# Altium schematic sheet ADC inputs.SchDoc
size A4
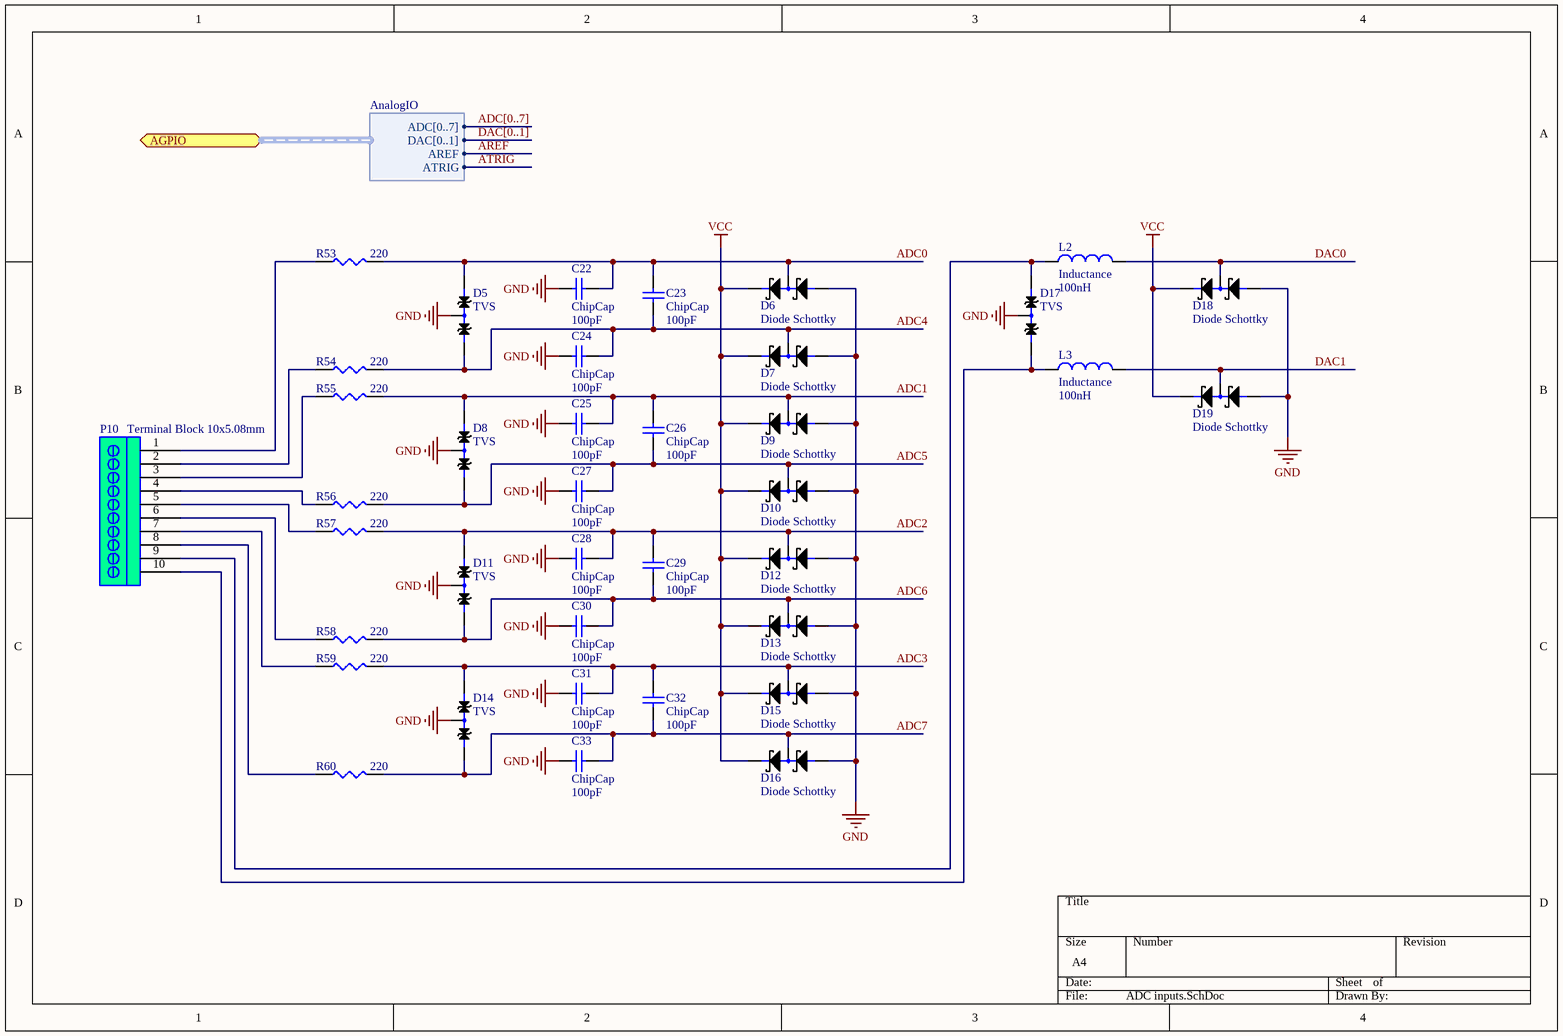
[diagram p0: ADC inputs.SchDoc]

## Parts
C22  ChipCap  value 100pF  [CAP0805]
C23  ChipCap  value 100pF  [CAP0805]
C24  ChipCap  value 100pF  [CAP0805]
C25  ChipCap  value 100pF  [CAP0805]
C26  ChipCap  value 100pF  [CAP0805]
C27  ChipCap  value 100pF  [CAP0805]
C28  ChipCap  value 100pF  [CAP0805]
C29  ChipCap  value 100pF  [CAP0805]
C30  ChipCap  value 100pF  [CAP0805]
C31  ChipCap  value 100pF  [CAP0805]
C32  ChipCap  value 100pF  [CAP0805]
C33  ChipCap  value 100pF  [CAP0805]
D5  TVS  [SOT23]
D6  Diode Schottky  [SOT23]
D7  Diode Schottky  [SOT23]
D8  TVS  [SOT23]
D9  Diode Schottky  [SOT23]
D10  Diode Schottky  [SOT23]
D11  TVS  [SOT23]
D12  Diode Schottky  [SOT23]
D13  Diode Schottky  [SOT23]
D14  TVS  [SOT23]
D15  Diode Schottky  [SOT23]
D16  Diode Schottky  [SOT23]
D17  TVS  [SOT23]
D18  Diode Schottky  [SOT23]
D19  Diode Schottky  [SOT23]
L2  Inductance  value 100nH  [CM45]
L3  Inductance  value 100nH  [CM45]
P10  Terminal Block 10x5.08mm  [Socket 10x5.08]
R53  value 220  [RES0805]  (hidden comment: ChipRes)
R54  value 220  [RES0805]  (hidden comment: ChipRes)
R55  value 220  [RES0805]  (hidden comment: ChipRes)
R56  value 220  [RES0805]  (hidden comment: ChipRes)
R57  value 220  [RES0805]  (hidden comment: ChipRes)
R58  value 220  [RES0805]  (hidden comment: ChipRes)
R59  value 220  [RES0805]  (hidden comment: ChipRes)
R60  value 220  [RES0805]  (hidden comment: ChipRes)

## Ports
AGPIO (harness AnalogIO)

## Harnesses
AnalogIO: ADC[0..7], DAC[0..1], AREF, ATRIG

## Nets
GND: C22.2 C24.2 C25.2 C27.2 C28.2 C30.2 C31.2 C33.2 D5.3 D6.1 D7.1 D8.3 D9.1 D10.1 D11.3 D12.1 D13.1 D14.3 D15.1 D16.1 D17.3 D18.1 D19.1
VCC: D6.2 D7.2 D9.2 D10.2 D12.2 D13.2 D15.2 D16.2 D18.2 D19.2
ADC0: C22.1 C23.2 D5.1 D6.3 R53.2
ADC1: C25.1 C26.2 D8.1 D9.3 R55.2
ADC2: C28.1 C29.2 D11.1 D12.3 R57.2
ADC3: C31.1 C32.2 D14.1 D15.3 R59.2
ADC4: C23.1 C24.1 D5.2 D7.3 R54.2
ADC5: C26.1 C27.1 D8.2 D10.3 R56.2
ADC6: C29.1 C30.1 D11.2 D13.3 R58.2
ADC7: C32.1 C33.1 D14.2 D16.3 R60.2
AREF: port AGPIO.AREF
ATRIG: port AGPIO.ATRIG
DAC0: D18.3 L2.1
DAC1: D19.3 L3.1
NetD17_1: D17.1 L2.2 P10.9
NetD17_2: D17.2 L3.2 P10.10
NetP10_1: P10.1 R53.1
NetP10_2: P10.2 R54.1
NetP10_3: P10.3 R55.1
NetP10_4: P10.4 R56.1
NetP10_5: P10.5 R57.1
NetP10_6: P10.6 R58.1
NetP10_7: P10.7 R59.1
NetP10_8: P10.8 R60.1

## Buses and harness runs
bus ADC[0..7]
bus DAC[0..1]

## Library data of the parts
C22-C33 = ChipCap: Capacitor; Published: 8-Jun-2000; LatestRevisionDate: 17-Jul-2002; LatestRevisionNote: Re-released for DXP Platform.; PackageReference: RAD-0.3; Publisher: Altium Limited
D5 D8 D11 D14 D17 = TVS Diode: Dual bidirectional voltage supresor
D6 D7 D9 D10 D12 D13 D15 D16 D18 D19 = Schottky Diode: 2-Diode Schottky
L2 L3 = ChipInductance
P10 = Socket_10x5.08_RA_2Wall: Terminal Block Socket Right Angle 10x5.08mm 2-Wall
R53-R60 = ChipRes: Chip resistor